# Altium schematic sheet main.SchDoc: 2306 front panel
size 420 x 297 mm; Date: 2021-12-08; Author: Joachim Löfwander; Revision: AAA-000; SheetNumber: 1; SheetTotal: 1; Website: github.com/jlofw
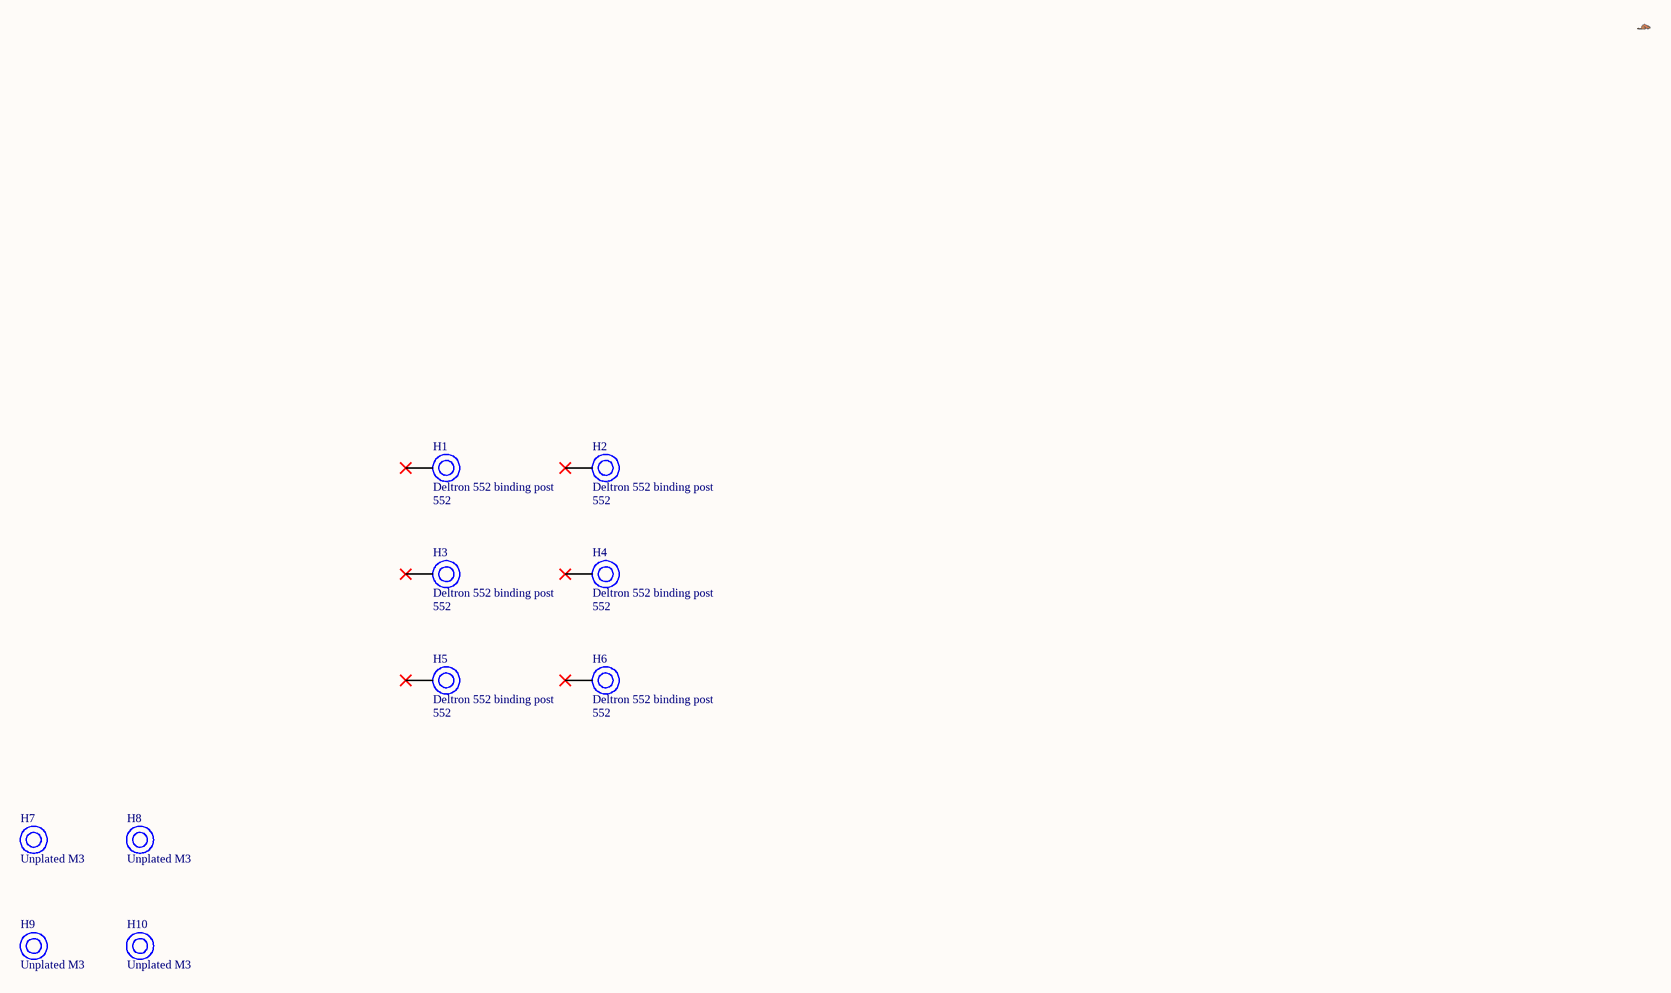
[diagram p0: main.SchDoc]

## Parts
H1  Deltron 552 binding post  Manufacturer P/N: 552  [deltron_552]  (no BOM)
H2  Deltron 552 binding post  Manufacturer P/N: 552  [deltron_552]  (no BOM)
H3  Deltron 552 binding post  Manufacturer P/N: 552  [deltron_552]  (no BOM)
H4  Deltron 552 binding post  Manufacturer P/N: 552  [deltron_552]  (no BOM)
H5  Deltron 552 binding post  Manufacturer P/N: 552  [deltron_552]  (no BOM)
H6  Deltron 552 binding post  Manufacturer P/N: 552  [deltron_552]  (no BOM)
H7  Unplated M3  [MountingHole_3.2mm_M3_NPTH]  (no BOM)
H8  Unplated M3  [MountingHole_3.2mm_M3_NPTH]  (no BOM)
H9  Unplated M3  [MountingHole_3.2mm_M3_NPTH]  (no BOM)
H10  Unplated M3  [MountingHole_3.2mm_M3_NPTH]  (no BOM)
logo1  beaver  [beaver]  (value not drawn)

## Nets

Not connected (* = marked no-connect by the designer): H1 1*; H2 1*; H3 1*; H4 1*; H5 1*; H6 1*

## Notes on the sheet
- PROJECT
- TITLE
- FILE NAME
- DATE MODIFIED
- SHEET
- REV
- OF
- AUTHOR
- WEBSITE

## Library data of the parts
H1-H6 = 110032: Internal Number: 110032; Manufacturer: Deltron
H7-H10 = 3: Internal Number: 3
logo1 = 4: Internal Number: 4